# Altium schematic sheet Flash_Driver.SchDoc
size A4; SheetNumber: 4; SheetTotal: 9
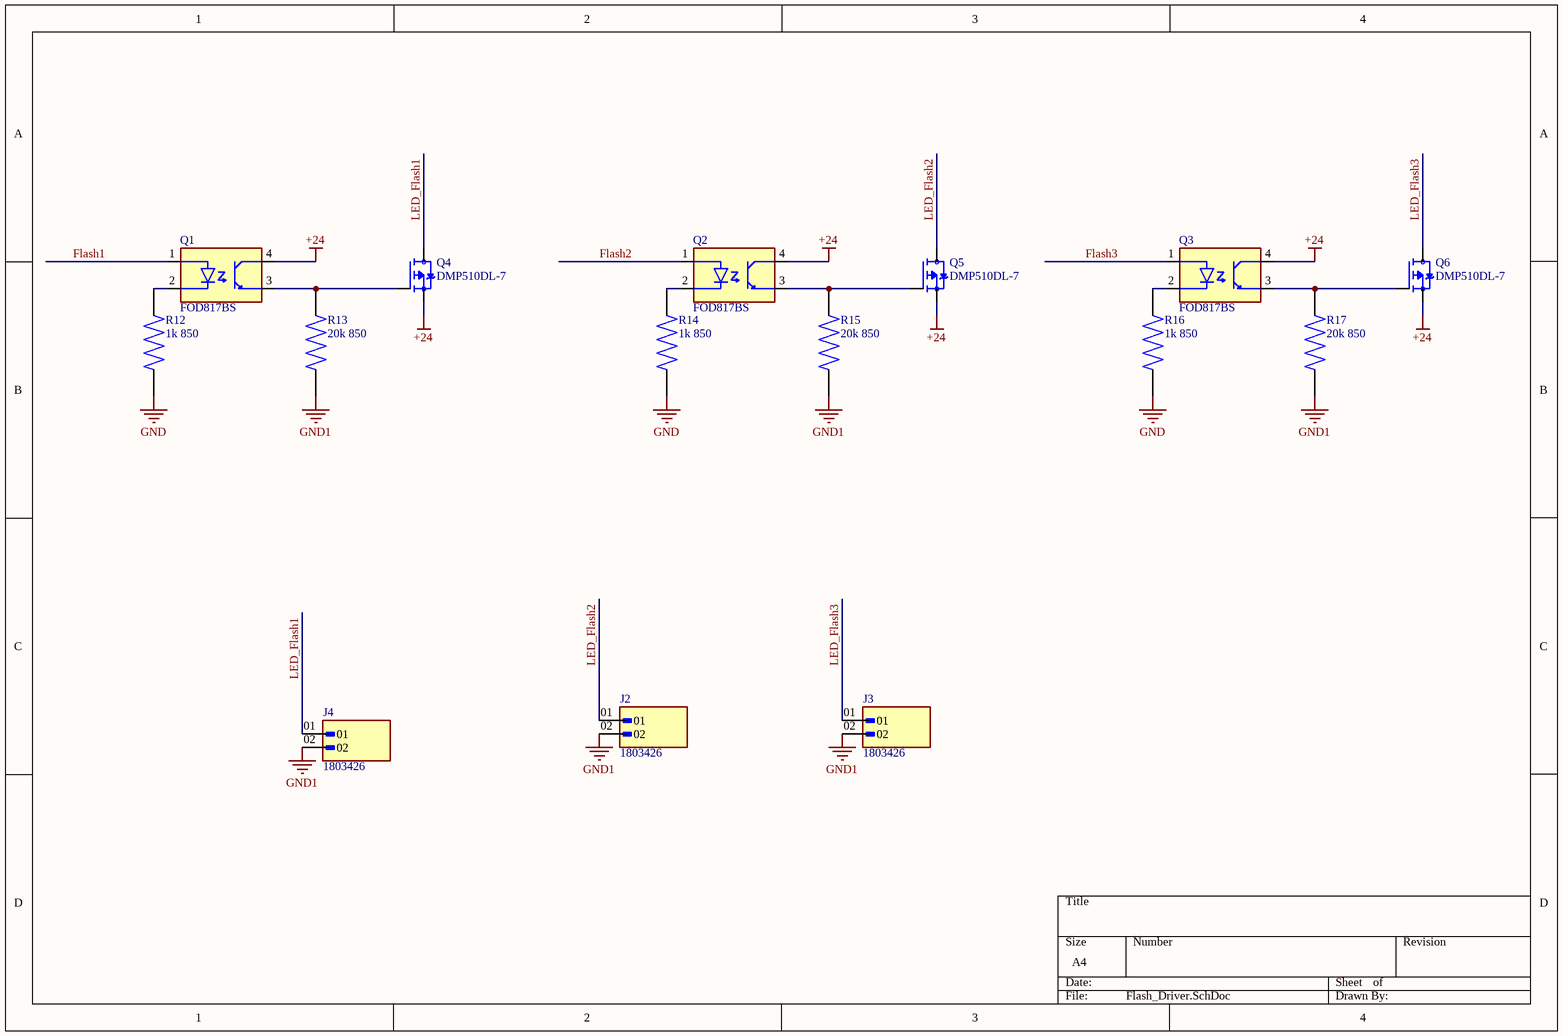
[diagram p0: Flash_Driver.SchDoc]

## Parts
J2  1803426  [PHOENIX_1803426]
J3  1803426  [PHOENIX_1803426]
J4  1803426  [PHOENIX_1803426]
Q1  FOD817BS  [SOIC254P1016X385-4N]
Q2  FOD817BS  [SOIC254P1016X385-4N]
Q3  FOD817BS  [SOIC254P1016X385-4N]
Q4  DMP510DL-7  [SOT91P240X110-3N - duplicate]
Q5  DMP510DL-7  [SOT91P240X110-3N - duplicate]
Q6  DMP510DL-7  [SOT91P240X110-3N - duplicate]
R12  1k 850  [10k 850]
R13  20k 850  [10k 850]
R14  1k 850  [10k 850]
R15  20k 850  [10k 850]
R16  1k 850  [10k 850]
R17  20k 850  [10k 850]

## Nets
+24: Q1.4(COLLECTOR) Q2.4(COLLECTOR) Q3.4(COLLECTOR) Q4.2(S) Q5.2(S) Q6.2(S)
GND: R12.2 R14.2 R16.2
GND1: J2.02 J3.02 J4.02 R13.2 R15.2 R17.2
Flash1: Q1.1(ANODE)
Flash2: Q2.1(ANODE)
Flash3: Q3.1(ANODE)
LED_Flash1: J4.01 Q4.3(D)
LED_Flash2: J2.01 Q5.3(D)
LED_Flash3: J3.01 Q6.3(D)
NetQ1_2: Q1.2(CATHODE) R12.1
NetQ1_3: Q1.3(EMITTER) Q4.1(G) R13.1
NetQ2_2: Q2.2(CATHODE) R14.1
NetQ2_3: Q2.3(EMITTER) Q5.1(G) R15.1
NetQ3_2: Q3.2(CATHODE) R16.1
NetQ3_3: Q3.3(EMITTER) Q6.1(G) R17.1

## Library data of the parts
J2-J4 = 1803426: Pluggable Header 3.81mm 16AWG 160V 8A 2 Position COMBICON MCV Series | Phoenix Contact 1803426; SnapEDA_Link: https://www.snapeda.com/parts/1803426/Phoenix+Contact/view-part/?ref=snap; Package: None; Value: *; MF: Phoenix Contact; MP: 1803426; Check_prices: https://www.snapeda.com/parts/1803426/Phoenix+Contact/view-part/?ref=eda
Q1-Q3 = FOD817BS: Transistor Output Optocouplers Opto Phototransistor Output SM-DIP4; MF: ON Semiconductor; SnapEDA_Link: https://www.snapeda.com/parts/FOD817BS/Onsemi/view-part/?ref=snap; Package: SMD-4 ON Semiconductor; Value: *; MP: FOD817BS; Check_prices: https://www.snapeda.com/parts/FOD817BS/Onsemi/view-part/?ref=eda
R12-R17 = 10k 850